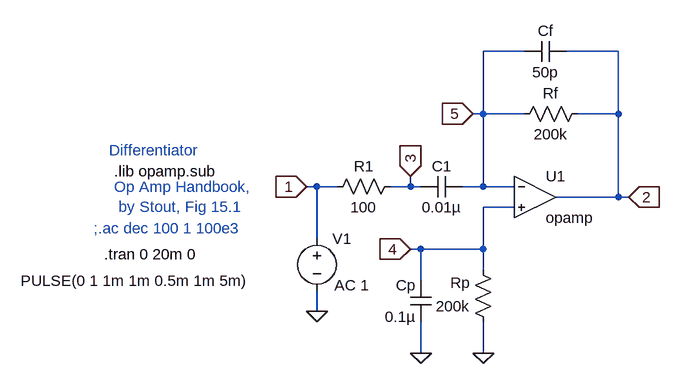
[diagram p0: schematic differentiator.asc]
differentiator.asc, the LTspice schematic file:
Version 4
SHEET 1 880 680
WIRE 176 -80 112 -80
WIRE 320 -80 240 -80
WIRE 112 16 112 -80
WIRE 112 16 96 16
WIRE 176 16 112 16
WIRE 320 16 320 -80
WIRE 320 16 256 16
WIRE -144 128 -160 128
WIRE -112 128 -144 128
WIRE 0 128 0 112
WIRE 0 128 -32 128
WIRE 16 128 0 128
WIRE 112 128 112 16
WIRE 112 128 80 128
WIRE 160 128 112 128
WIRE 320 144 320 16
WIRE 320 144 224 144
WIRE 336 144 320 144
WIRE 160 160 112 160
WIRE -144 208 -144 128
WIRE 16 224 0 224
WIRE 112 224 112 160
WIRE 112 224 16 224
WIRE 112 256 112 224
WIRE 16 272 16 224
WIRE -144 320 -144 288
WIRE 16 384 16 336
WIRE 112 384 112 336
FLAG -144 320 0
FLAG 16 384 0
FLAG 112 384 0
FLAG -160 128 1
IOPIN -160 128 In
FLAG 0 112 3
IOPIN 0 112 In
FLAG 96 16 5
IOPIN 96 16 In
FLAG 0 224 4
IOPIN 0 224 In
FLAG 336 144 2
IOPIN 336 144 In
SYMBOL OpAmps\\opamp 192 80 R0
SYMATTR InstName U1
SYMBOL voltage -144 192 R0
WINDOW 123 27 88 Left 2
WINDOW 39 0 0 Left 0
WINDOW 3 -456 81 Left 2
SYMATTR Value2 AC 1
SYMATTR Value PULSE(0 1 1m 1m 0.5m 1m 5m)
SYMATTR InstName V1
SYMBOL res -16 112 R90
WINDOW 0 0 56 VBottom 2
WINDOW 3 32 56 VTop 2
SYMATTR InstName R1
SYMATTR Value 100
SYMBOL res 272 0 R90
WINDOW 0 0 56 VBottom 2
WINDOW 3 32 56 VTop 2
SYMATTR InstName Rf
SYMATTR Value 200k
SYMBOL res 128 352 R180
WINDOW 0 36 76 Left 2
WINDOW 3 36 40 Left 2
SYMATTR InstName Rp
SYMATTR Value 200k
SYMBOL cap 80 112 R90
WINDOW 0 0 32 VBottom 2
WINDOW 3 32 32 VTop 2
SYMATTR InstName C1
SYMATTR Value 0.01µ
SYMBOL cap 240 -96 R90
WINDOW 0 0 32 VBottom 2
WINDOW 3 32 32 VTop 2
SYMATTR InstName Cf
SYMATTR Value 50p
SYMBOL cap 32 336 R180
WINDOW 0 24 56 Left 2
WINDOW 3 24 8 Left 2
SYMATTR InstName Cp
SYMATTR Value 0.1µ
TEXT -456 104 Left 2 !.lib opamp.sub
TEXT -456 128 Left 2 ;Op Amp Handbook,\n by Stout, Fig 15.1
TEXT -488 192 Left 2 ;;.ac dec 100 1 100e3
TEXT -464 72 Left 2 ;Differentiator
TEXT -472 232 Left 2 !.tran 0 20m 0

The netlist it stands for:
* differentiator.asc
XU1 5 4 2 opamp Aol=100K GBW=10Meg  ; pins invin noninvin out
V1 1 0 PULSE(0 1 1m 1m 0.5m 1m 5m) AC 1
R1 3 1 100
Rf 2 5 200k
Rp 0 4 200k
C1 5 3 0.01µ
Cf 2 5 50p
Cp 0 4 0.1µ
.lib opamp.sub
* Op Amp Handbook,
*  by Stout, Fig 15.1
* ;.ac dec 100 1 100e3
* Differentiator
.tran 0 20m 0
.backanno
.end